# Altium schematic sheet Alimentacion.SchDoc
size A4
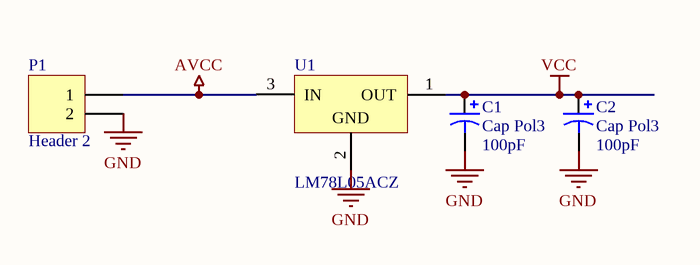
[diagram p0: Alimentacion.SchDoc]

## Parts
C1  Cap Pol3  value 100pF  [C0805]
C2  Cap Pol3  value 100pF  [C0805]
P1  Header 2  [HDR1X2]
U1  LM78L05ACZ  [Z03A]

## Nets
AVCC: P1.1 U1.3(IN)
GND: C1.2 C2.2 P1.2 U1.2(GND)
VCC: C1.1 C2.1 U1.1(OUT)

## Library data of the parts
C1 C2 = Cap Pol3: Polarized Capacitor (Surface Mount); Published: 8-Jun-2000; LatestRevisionDate: 17-Jul-2002; LatestRevisionNote: Re-released for DXP Platform.; PackageReference: C0805; Publisher: Altium Limited
P1 = Header 2: Header, 2-Pin; LatestRevisionDate: 17-Jul-2002; LatestRevisionNote: Re-released for DXP Platform.; Publisher: Altium Limited
U1 = LM78L05ACZ: 3-Terminal Positive Regulators; Manufacturer: National Semiconductor; CompType: LDO IC; PackageTopMarking: NSXYTT*LM78L*05ACZ; Published: 27-Nov-2008; DatasheetVersion: Apr-2006; PackageVersion: revG, Sep-2000; PackageReference: Z03A; Publisher: Altium Limited; PackageDescription: TO-92, Molded, 3 Lead; PartNumber: LM78L05ACZ; RoHS: O; PinCount: 3; DigiKeyPartNumber: LM78L05ACZNS-ND; Code_JEDEC: TO-226-AA; ComponentLink1Description: LM78L05 Datasheet; ComponentLink1URL: http://www.national.com/ds/LM/LM78L05.pdf; ComponentLink2Description: LM78L05 Web Page; ComponentLink2URL: http://www.national.com/pf/LM/LM78L05.html; ComponentLink3Description: Z03A Package Page; ComponentLink3URL: http://www.national.com/packaging/folders/z03a.html